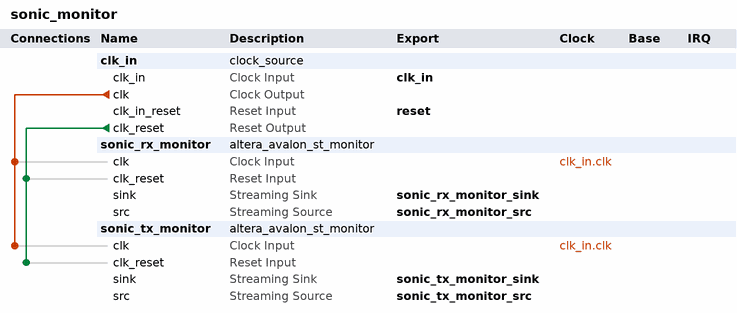
[diagram p0: system contents]
# Platform Designer (Qsys) system sonic_monitor
# Parameters at their usual value, and those the tool derives, are not listed.
package require -exact qsys 11.0
create_system sonic_monitor
set_project_property DEVICE_FAMILY STRATIXIV

add_instance clk_in clock_source 11.0
set_instance_parameter_value clk_in clockFrequency 250000000

add_instance sonic_rx_monitor altera_avalon_st_monitor 11.0
set_instance_parameter_value sonic_rx_monitor USE_PACKET 1
set_instance_parameter_value sonic_rx_monitor USE_CHANNEL 0
set_instance_parameter_value sonic_rx_monitor USE_ERROR 1
set_instance_parameter_value sonic_rx_monitor USE_READY 1
set_instance_parameter_value sonic_rx_monitor USE_VALID 1
set_instance_parameter_value sonic_rx_monitor USE_EMPTY 1
set_instance_parameter_value sonic_rx_monitor ST_SYMBOL_W 32
set_instance_parameter_value sonic_rx_monitor ST_NUMSYMBOLS 4
set_instance_parameter_value sonic_rx_monitor ST_CHANNEL_W 1
set_instance_parameter_value sonic_rx_monitor ST_ERROR_W 1
set_instance_parameter_value sonic_rx_monitor ST_READY_LATENCY 0
set_instance_parameter_value sonic_rx_monitor ST_BEATSPERCYCLE 1
set_instance_parameter_value sonic_rx_monitor ST_MAX_CHANNELS 0
set_instance_parameter_value sonic_rx_monitor ST_MAX_PACKET_SIZE 1000

add_instance sonic_tx_monitor altera_avalon_st_monitor 11.0
set_instance_parameter_value sonic_tx_monitor USE_PACKET 1
set_instance_parameter_value sonic_tx_monitor USE_CHANNEL 0
set_instance_parameter_value sonic_tx_monitor USE_ERROR 1
set_instance_parameter_value sonic_tx_monitor USE_READY 1
set_instance_parameter_value sonic_tx_monitor USE_VALID 1
set_instance_parameter_value sonic_tx_monitor USE_EMPTY 1
set_instance_parameter_value sonic_tx_monitor ST_SYMBOL_W 32
set_instance_parameter_value sonic_tx_monitor ST_NUMSYMBOLS 4
set_instance_parameter_value sonic_tx_monitor ST_CHANNEL_W 1
set_instance_parameter_value sonic_tx_monitor ST_ERROR_W 1
set_instance_parameter_value sonic_tx_monitor ST_READY_LATENCY 0
set_instance_parameter_value sonic_tx_monitor ST_BEATSPERCYCLE 1
set_instance_parameter_value sonic_tx_monitor ST_MAX_CHANNELS 0
set_instance_parameter_value sonic_tx_monitor ST_MAX_PACKET_SIZE 1000

# connections
add_connection clk_in.clk sonic_rx_monitor.clk clock
add_connection clk_in.clk sonic_tx_monitor.clk clock
add_connection clk_in.clk_reset sonic_rx_monitor.clk_reset reset
add_connection clk_in.clk_reset sonic_tx_monitor.clk_reset reset

# exported interfaces
add_interface clk_in clock sink
set_interface_property clk_in EXPORT_OF clk_in.clk_in
add_interface reset reset sink
set_interface_property reset EXPORT_OF clk_in.clk_in_reset
add_interface sonic_rx_monitor_src avalon_streaming source
set_interface_property sonic_rx_monitor_src EXPORT_OF sonic_rx_monitor.src
add_interface sonic_rx_monitor_sink avalon_streaming sink
set_interface_property sonic_rx_monitor_sink EXPORT_OF sonic_rx_monitor.sink
add_interface sonic_tx_monitor_src avalon_streaming source
set_interface_property sonic_tx_monitor_src EXPORT_OF sonic_tx_monitor.src
add_interface sonic_tx_monitor_sink avalon_streaming sink
set_interface_property sonic_tx_monitor_sink EXPORT_OF sonic_tx_monitor.sink

save_system sonic_monitor.qsys
